# Altium schematic sheet MCU.SchDoc
size A4; Author: Khanh BK; Organization: DB Bach Khoa HN; Address1: Bach Khoa- HBT - HN; Address2: khanh.db192932; Address3: Youtube: Đào Bá Khánh; Address4: 0357698570; Revision: 1.0Ver; SheetNumber: 2; SheetTotal: 9
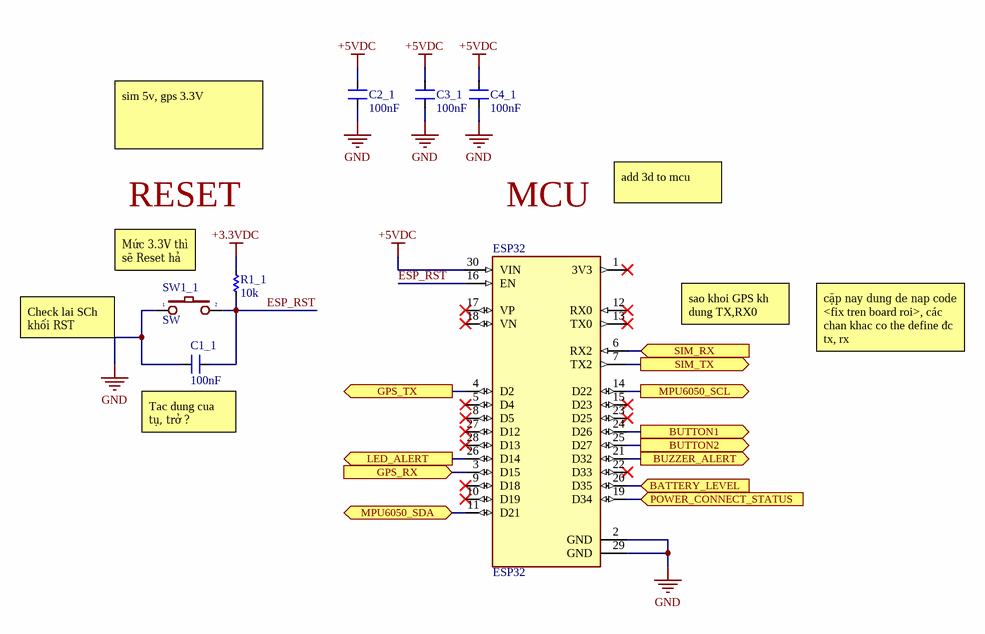
[diagram p0: MCU.SchDoc]

## Parts
C1_1  100nF  [CN-SMD-0805]
C2_1  100nF  [CN-SMD-0805]
C3_1  100nF  [CN-SMD-0805]
C4_1  100nF  [CN-SMD-0805]
ESP32  ESP32  [MODULE_ESP32_DEVKIT_V1]
R1_1  10k  [RES-SMD-0805]
SW1_1  SW  [SW1-DIP]

## Ports
BATTERY_LEVEL (in), BUTTON1 (out), BUTTON2 (out), BUZZER_ALERT (out), GPS_RX (in), GPS_TX (out), LED_ALERT (out), MPU6050_SCL (out), MPU6050_SDA (bidir), POWER_CONNECT_STATUS (in), SIM_RX (in), SIM_TX (out)

## Nets
+3.3VDC: R1_1.1
+5VDC: C2_1.2 C3_1.2 C4_1.2 ESP32.30(VIN)
GND: C1_1.1 C2_1.1 C3_1.1 C4_1.1 ESP32.2(GND) ESP32.29(GND) SW1_1.1
BATTERY_LEVEL: ESP32.20(D35) ; port BATTERY_LEVEL
BUTTON1: ESP32.24(D26) ; port BUTTON1
BUTTON2: ESP32.25(D27) ; port BUTTON2
BUZZER_ALERT: ESP32.21(D32) ; port BUZZER_ALERT
ESP_RST: C1_1.2 ESP32.16(EN) R1_1.2 SW1_1.2
GPS_RX: ESP32.3(D15) ; port GPS_RX
GPS_TX: ESP32.4(D2) ; port GPS_TX
LED_ALERT: ESP32.26(D14) ; port LED_ALERT
MPU6050_SCL: ESP32.14(D22) ; port MPU6050_SCL
MPU6050_SDA: ESP32.11(D21) ; port MPU6050_SDA
POWER_CONNECT_STATUS: ESP32.19(D34) ; port POWER_CONNECT_STATUS
SIM_RX: ESP32.6(RX2) ; port SIM_RX
SIM_TX: ESP32.7(TX2) ; port SIM_TX

Not connected (* = marked no-connect by the designer): ESP32 1(3V3)* 5(D4)* 8(D5)* 9(D18)* 10(D19)* 12(RX0)* 13(TX0)* 15(D23)* 17(VP)* 18(VN)* 22(D33)* 23(D25)* 27(D12)* 28(D13)*

## Notes on the sheet
- sim 5v, gps 3.3V
- RESET
- MCU
- add 3d to mcu
- Mức 3.3V thì sẽ Reset hả ?
- sao khoi GPS kh dung TX,RX0
- Check lai SCh khối RST
- cặp nay dung de nap code <fix tren board roi>, các chan khac co the define đc tx, rx
- (near C1_1) Tac dung cua tụ, trở ?
- Title
- Size:
- Date:
- Author:
- A4
- Time:
- Number:
- Checked:
- Revision:
- Sheet
- Approved:
- of
- File:

## Library data of the parts
C1_1 C2_1 C3_1 C4_1 = CN: Value: 33pF
ESP32 = ESP32-DEVKIT-V1: Dual core, Wi-Fi: 2.4 GHz up to 150 Mbits/s,BLE (Bluetooth Low Energy) and legacy Bluetooth, 32 bits, Up to 240 MHz; Value: *; MP: ESP32-DEVKIT-V1; Availability: Unavailable; Package: None; Price: None
R1_1 = Res-SMD: Resistor; Manufacturer: Generic Components; Class: Passive; Published: 08/06/2000; Publisher: Altium Hobart Technology Centre
SW1_1 = SW2: Switch button 2 pin; Value: SW chip 2 pin